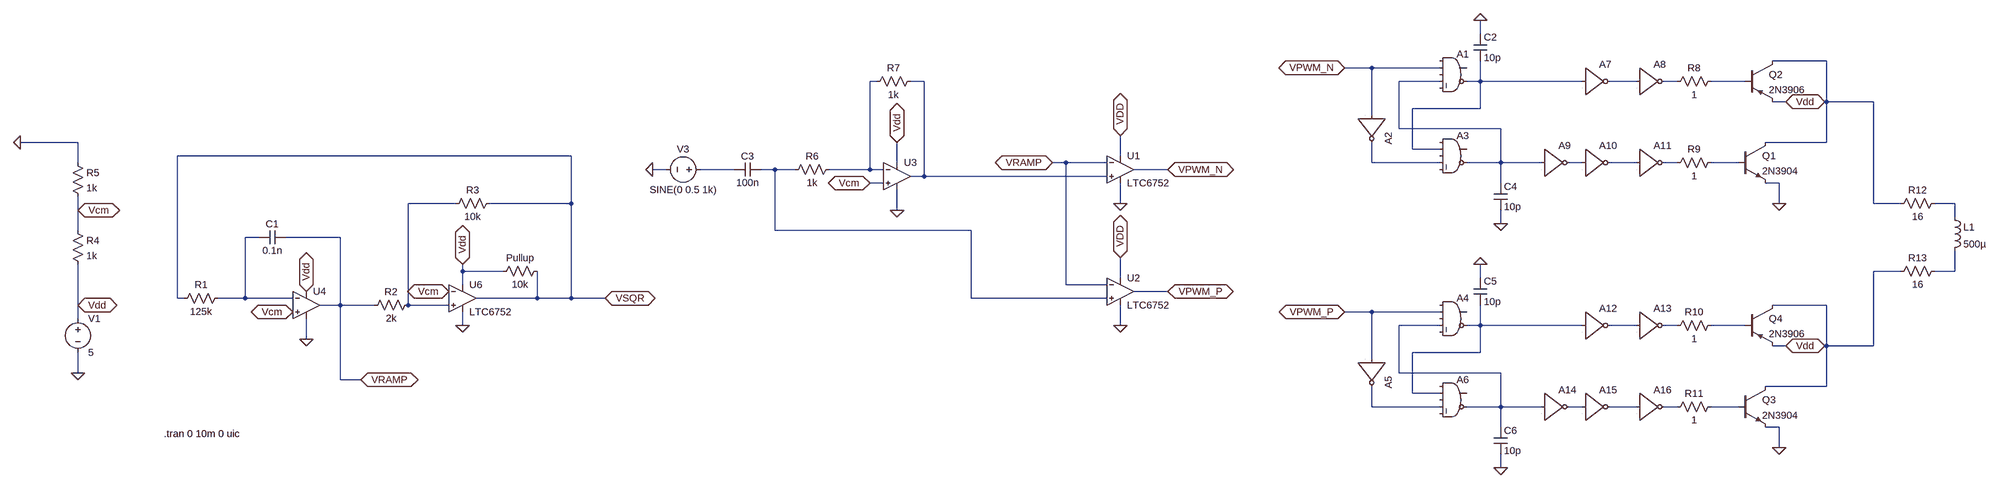
[diagram p0: schematic Experiment_5.asc]
Experiment_5.asc, the LTspice schematic file:
Version 4
SHEET 1 6772 1288
WIRE 5536 -432 5536 -464
WIRE 6352 -368 6224 -368
WIRE 5280 -352 5216 -352
WIRE 5440 -352 5280 -352
WIRE 3840 -320 3824 -320
WIRE 3952 -320 3920 -320
WIRE 5440 -320 5344 -320
WIRE 5536 -320 5536 -368
WIRE 5536 -320 5504 -320
WIRE 5776 -320 5536 -320
WIRE 5904 -320 5840 -320
WIRE 6000 -320 5968 -320
WIRE 6160 -320 6080 -320
WIRE 6256 -272 6224 -272
WIRE 6352 -272 6352 -368
WIRE 6496 -272 6352 -272
WIRE 5536 -256 5536 -320
WIRE 5536 -256 5376 -256
WIRE 5280 -240 5280 -352
WIRE 5344 -208 5344 -320
WIRE 5584 -208 5344 -208
WIRE 1936 -176 1792 -176
WIRE 6352 -176 6352 -272
WIRE 6352 -176 6208 -176
WIRE 5376 -160 5376 -256
WIRE 5440 -160 5376 -160
WIRE 3120 -144 2192 -144
WIRE 4496 -144 4496 -192
WIRE 1936 -128 1936 -176
WIRE 3888 -128 3888 -176
WIRE 4368 -128 4336 -128
WIRE 4464 -128 4368 -128
WIRE 5280 -128 5280 -176
WIRE 5440 -128 5280 -128
WIRE 5584 -128 5584 -208
WIRE 5584 -128 5504 -128
WIRE 5680 -128 5584 -128
WIRE 5776 -128 5744 -128
WIRE 5904 -128 5840 -128
WIRE 6000 -128 5968 -128
WIRE 6144 -128 6080 -128
WIRE 3344 -112 3312 -112
WIRE 3504 -112 3424 -112
WIRE 3600 -112 3568 -112
WIRE 3648 -112 3600 -112
WIRE 3824 -112 3824 -320
WIRE 3824 -112 3728 -112
WIRE 3856 -112 3824 -112
WIRE 4608 -112 4528 -112
WIRE 3952 -96 3952 -320
WIRE 3952 -96 3920 -96
WIRE 4464 -96 3952 -96
WIRE 3856 -80 3824 -80
WIRE 5584 -80 5584 -128
WIRE 6240 -80 6208 -80
WIRE 2848 -32 2736 -32
WIRE 3120 -32 3120 -144
WIRE 3120 -32 2928 -32
WIRE 4496 -32 4496 -80
WIRE 6240 -32 6240 -80
WIRE 6496 -32 6496 -272
WIRE 6560 -32 6496 -32
WIRE 6688 -32 6640 -32
WIRE 1936 -16 1936 -48
WIRE 3888 -16 3888 -64
WIRE 6688 0 6688 -32
WIRE 5584 16 5584 -16
WIRE 1936 32 1936 -16
WIRE 3600 32 3600 -112
WIRE 4144 32 3600 32
WIRE 2384 48 2352 48
WIRE 2576 48 2448 48
WIRE 2864 128 2864 112
WIRE 2960 128 2864 128
WIRE 6560 128 6496 128
WIRE 6688 128 6688 80
WIRE 6688 128 6640 128
WIRE 4496 144 4496 96
WIRE 5536 144 5536 112
WIRE 2864 160 2864 128
WIRE 4368 160 4368 -128
WIRE 4464 160 4368 160
WIRE 4608 176 4528 176
WIRE 2192 192 2192 -144
WIRE 2208 192 2192 192
WIRE 2352 192 2352 48
WIRE 2352 192 2288 192
WIRE 2464 192 2352 192
WIRE 3040 192 3040 128
WIRE 3040 192 2896 192
WIRE 3120 192 3120 -32
WIRE 3120 192 3040 192
WIRE 3200 192 3120 192
WIRE 4144 192 4144 32
WIRE 4464 192 4144 192
WIRE 1936 208 1936 112
WIRE 2576 208 2576 48
WIRE 2576 208 2528 208
WIRE 2656 208 2576 208
WIRE 2736 208 2736 -32
WIRE 2832 208 2736 208
WIRE 6352 208 6224 208
WIRE 5280 224 5216 224
WIRE 5440 224 5280 224
WIRE 1936 240 1936 208
WIRE 2864 256 2864 224
WIRE 4496 256 4496 208
WIRE 5440 256 5344 256
WIRE 5536 256 5536 208
WIRE 5536 256 5504 256
WIRE 5776 256 5536 256
WIRE 5904 256 5840 256
WIRE 6000 256 5968 256
WIRE 6160 256 6080 256
WIRE 2496 288 2496 240
WIRE 6256 304 6224 304
WIRE 6352 304 6352 208
WIRE 6496 304 6496 128
WIRE 6496 304 6352 304
WIRE 5536 320 5536 256
WIRE 5536 320 5376 320
WIRE 5280 336 5280 224
WIRE 1936 368 1936 320
WIRE 5344 368 5344 256
WIRE 5584 368 5344 368
WIRE 2576 384 2576 208
WIRE 2624 384 2576 384
WIRE 6352 400 6352 304
WIRE 6352 400 6208 400
WIRE 5376 416 5376 320
WIRE 5440 416 5376 416
WIRE 5280 448 5280 400
WIRE 5440 448 5280 448
WIRE 5584 448 5584 368
WIRE 5584 448 5504 448
WIRE 5680 448 5584 448
WIRE 5776 448 5744 448
WIRE 5904 448 5840 448
WIRE 6000 448 5968 448
WIRE 6144 448 6080 448
WIRE 5584 496 5584 448
WIRE 6240 496 6208 496
WIRE 6240 544 6240 496
WIRE 5584 592 5584 560
FLAG 2864 256 0
FLAG 1936 368 0
FLAG 1936 208 Vdd
IOPIN 1936 208 BiDir
FLAG 2496 288 0
FLAG 2864 112 Vdd
IOPIN 2864 112 BiDir
FLAG 2832 176 Vcm
IOPIN 2832 176 BiDir
FLAG 2496 176 Vdd
IOPIN 2496 176 BiDir
FLAG 2464 224 Vcm
IOPIN 2464 224 BiDir
FLAG 3200 192 VSQR
IOPIN 3200 192 BiDir
FLAG 2624 384 VRAMP
IOPIN 2624 384 BiDir
FLAG 3888 -16 0
FLAG 3888 -176 Vdd
IOPIN 3888 -176 BiDir
FLAG 3824 -80 Vcm
IOPIN 3824 -80 BiDir
FLAG 3312 -112 0
FLAG 4496 256 0
FLAG 4496 96 VDD
IOPIN 4496 96 BiDir
FLAG 4496 -32 0
FLAG 4496 -192 VDD
IOPIN 4496 -192 BiDir
FLAG 4336 -128 VRAMP
IOPIN 4336 -128 BiDir
FLAG 4608 -112 VPWM_N
IOPIN 4608 -112 BiDir
FLAG 4608 176 VPWM_P
IOPIN 4608 176 BiDir
FLAG 1792 -176 0
FLAG 1936 -16 Vcm
IOPIN 1936 -16 BiDir
FLAG 5584 16 0
FLAG 5536 -464 0
FLAG 5584 592 0
FLAG 5536 112 0
FLAG 5216 -352 VPWM_N
IOPIN 5216 -352 BiDir
FLAG 5216 224 VPWM_P
IOPIN 5216 224 BiDir
FLAG 6240 -32 0
FLAG 6256 -272 Vdd
IOPIN 6256 -272 BiDir
FLAG 6240 544 0
FLAG 6256 304 Vdd
IOPIN 6256 304 BiDir
SYMBOL res 2944 -48 R90
WINDOW 0 0 56 VBottom 2
WINDOW 3 32 56 VTop 2
SYMATTR InstName R3
SYMATTR Value 10k
SYMBOL res 2304 176 R90
WINDOW 0 0 56 VBottom 2
WINDOW 3 32 56 VTop 2
SYMATTR InstName R1
SYMATTR Value 125k
SYMBOL cap 2448 32 R90
WINDOW 0 0 32 VBottom 2
WINDOW 3 32 32 VTop 2
SYMATTR InstName C1
SYMATTR Value 0.1n
SYMBOL res 2752 192 R90
WINDOW 0 0 56 VBottom 2
WINDOW 3 32 56 VTop 2
SYMATTR InstName R2
SYMATTR Value 2k
SYMBOL voltage 1936 224 R0
WINDOW 123 0 0 Left 0
WINDOW 39 0 0 Left 0
SYMATTR InstName V1
SYMATTR Value 5
SYMBOL Opamps\\UniversalOpamp2 2496 208 R0
SYMATTR InstName U4
SYMBOL Comparators\\LTC6752 2864 128 R0
SYMATTR InstName U6
SYMBOL res 3056 112 R90
WINDOW 0 0 56 VBottom 2
WINDOW 3 32 56 VTop 2
SYMATTR InstName Pullup
SYMATTR Value 10k
SYMBOL cap 3568 -128 R90
WINDOW 0 0 32 VBottom 2
WINDOW 3 32 32 VTop 2
SYMATTR InstName C3
SYMATTR Value 100n
SYMBOL res 3744 -128 R90
WINDOW 0 0 56 VBottom 2
WINDOW 3 32 56 VTop 2
SYMATTR InstName R6
SYMATTR Value 1k
SYMBOL res 3936 -336 R90
WINDOW 0 0 56 VBottom 2
WINDOW 3 32 56 VTop 2
SYMATTR InstName R7
SYMATTR Value 1k
SYMBOL voltage 3440 -112 R90
WINDOW 0 -32 56 VBottom 2
WINDOW 3 32 56 VTop 2
WINDOW 123 0 0 Left 0
WINDOW 39 0 0 Left 0
SYMATTR InstName V3
SYMATTR Value SINE(0 0.5 1k)
SYMBOL Opamps\\UniversalOpamp2 3888 -96 R0
SYMATTR InstName U3
SYMBOL Comparators\\LTC6752 4496 -176 R0
SYMATTR InstName U1
SYMBOL Comparators\\LTC6752 4496 112 R0
SYMATTR InstName U2
SYMBOL res 1920 16 R0
SYMATTR InstName R4
SYMATTR Value 1k
SYMBOL res 1920 -144 R0
SYMATTR InstName R5
SYMATTR Value 1k
SYMBOL Digital\\and 5472 -400 R0
WINDOW 3 16 112 Invisible 2
SYMATTR InstName A1
SYMATTR Value Vhigh=5 Vlow=0
SYMATTR Value2 Td=10n
SYMBOL cap 5520 -432 R0
SYMATTR InstName C2
SYMATTR Value 10p
SYMBOL cap 5568 -80 R0
SYMATTR InstName C4
SYMATTR Value 10p
SYMBOL cap 5520 144 R0
SYMATTR InstName C5
SYMATTR Value 10p
SYMBOL cap 5568 496 R0
SYMATTR InstName C6
SYMATTR Value 10p
SYMBOL Digital\\inv 5776 -384 R0
WINDOW 3 8 104 Invisible 2
SYMATTR InstName A7
SYMATTR Value Vhigh=5 Vlow=0
SYMATTR Value2 Trise=5n Tfall=5n Td=5n
SYMBOL res 6096 -336 R90
WINDOW 0 0 56 VBottom 2
WINDOW 3 32 56 VTop 2
SYMATTR InstName R8
SYMATTR Value 1
SYMBOL res 6096 -144 R90
WINDOW 0 0 56 VBottom 2
WINDOW 3 32 56 VTop 2
SYMATTR InstName R9
SYMATTR Value 1
SYMBOL npn 6144 -176 R0
SYMATTR InstName Q1
SYMATTR Value 2N3904
SYMBOL pnp 6160 -368 R0
SYMATTR InstName Q2
SYMATTR Value 2N3906
SYMBOL res 6096 240 R90
WINDOW 0 0 56 VBottom 2
WINDOW 3 32 56 VTop 2
SYMATTR InstName R10
SYMATTR Value 1
SYMBOL res 6096 432 R90
WINDOW 0 0 56 VBottom 2
WINDOW 3 32 56 VTop 2
SYMATTR InstName R11
SYMATTR Value 1
SYMBOL npn 6144 400 R0
SYMATTR InstName Q3
SYMATTR Value 2N3904
SYMBOL pnp 6160 208 R0
SYMATTR InstName Q4
SYMATTR Value 2N3906
SYMBOL res 6656 -48 R90
WINDOW 0 0 56 VBottom 2
WINDOW 3 32 56 VTop 2
SYMATTR InstName R12
SYMATTR Value 16
SYMBOL res 6656 112 R90
WINDOW 0 0 56 VBottom 2
WINDOW 3 32 56 VTop 2
SYMATTR InstName R13
SYMATTR Value 16
SYMBOL Digital\\inv 5904 -384 R0
WINDOW 3 8 104 Invisible 2
SYMATTR InstName A8
SYMATTR Value Vhigh=5 Vlow=0
SYMATTR Value2 Trise=5n Tfall=5n Td=5n
SYMBOL Digital\\inv 5776 -192 R0
WINDOW 3 8 104 Invisible 2
SYMATTR InstName A10
SYMATTR Value Vhigh=5 Vlow=0
SYMATTR Value2 Trise=5n Tfall=5n Td=5n
SYMBOL Digital\\inv 5904 -192 R0
WINDOW 3 8 104 Invisible 2
SYMATTR InstName A11
SYMATTR Value Vhigh=5 Vlow=0
SYMATTR Value2 Trise=5n Tfall=5n Td=5n
SYMBOL Digital\\inv 5776 192 R0
WINDOW 3 8 104 Invisible 2
SYMATTR InstName A12
SYMATTR Value Vhigh=5 Vlow=0
SYMATTR Value2 Trise=5n Tfall=5n Td=5n
SYMBOL Digital\\inv 5904 192 R0
WINDOW 3 8 104 Invisible 2
SYMATTR InstName A13
SYMATTR Value Vhigh=5 Vlow=0
SYMATTR Value2 Trise=5n Tfall=5n Td=5n
SYMBOL Digital\\inv 5680 384 R0
WINDOW 3 8 104 Invisible 2
SYMATTR InstName A14
SYMATTR Value Vhigh=5 Vlow=0
SYMATTR Value2 Trise=5n Tfall=5n Td=5n
SYMBOL Digital\\inv 5776 384 R0
WINDOW 3 8 104 Invisible 2
SYMATTR InstName A15
SYMATTR Value Vhigh=5 Vlow=0
SYMATTR Value2 Trise=5n Tfall=5n Td=5n
SYMBOL Digital\\inv 5904 384 R0
WINDOW 3 8 104 Invisible 2
SYMATTR InstName A16
SYMATTR Value Vhigh=5 Vlow=0
SYMATTR Value2 Trise=5n Tfall=5n Td=5n
SYMBOL ind 6672 -16 R0
SYMATTR InstName L1
SYMATTR Value 500µ
SYMBOL Digital\\inv 5344 -240 R90
WINDOW 3 8 104 Invisible 2
SYMATTR InstName A2
SYMATTR Value Vhigh=5 Vlow=0
SYMATTR Value2 Trise=5n Tfall=5n Td=5n
SYMBOL Digital\\inv 5344 336 R90
WINDOW 3 8 104 Invisible 2
SYMATTR InstName A5
SYMATTR Value Vhigh=5 Vlow=0
SYMATTR Value2 Trise=5n Tfall=5n Td=5n
SYMBOL Digital\\inv 5680 -192 R0
WINDOW 3 8 104 Invisible 2
SYMATTR InstName A9
SYMATTR Value Vhigh=5 Vlow=0
SYMATTR Value2 Trise=5n Tfall=5n Td=5n
SYMBOL Digital\\and 5472 -208 R0
WINDOW 3 16 112 Invisible 2
SYMATTR InstName A3
SYMATTR Value Vhigh=5 Vlow=0
SYMATTR Value2 Td=10n
SYMBOL Digital\\and 5472 176 R0
WINDOW 3 16 112 Invisible 2
SYMATTR InstName A4
SYMATTR Value Vhigh=5 Vlow=0
SYMATTR Value2 Td=10n
SYMBOL Digital\\and 5472 368 R0
WINDOW 3 16 112 Invisible 2
SYMATTR InstName A6
SYMATTR Value Vhigh=5 Vlow=0
SYMATTR Value2 Td=10n
TEXT 2160 512 Left 2 !.tran 0 10m 0 uic

The netlist it stands for:
* Experiment_5.asc
R3 VSQR N016 10k
R1 N018 VSQR 125k
C1 VRAMP N018 0.1n
R2 N016 VRAMP 2k
V1 Vdd 0 5
XU4 Vcm N018 Vdd 0 VRAMP level.2 Avol=1Meg GBW=10Meg Slew=10Meg ilimit=25m rail=0 Vos=0 phimargin=45 en=0 enk=0 in=0 ink=0 Rin=500Meg  ; pins IN+ IN- V+ V- OUT
XU6 N016 Vcm Vdd 0 VSQR LTC6752  ; pins In+ In- V+ V- OUT
R§Pullup VSQR Vdd 10k
C3 N015 N014 100n
R6 N002 N015 1k
R7 N003 N002 1k
V3 N014 0 SINE(0 0.5 1k)
XU3 Vcm N002 Vdd 0 N003 level.2 Avol=1Meg GBW=10Meg Slew=10Meg ilimit=25m rail=0 Vos=0 phimargin=45 en=0 enk=0 in=0 ink=0 Rin=500Meg  ; pins IN+ IN- V+ V- OUT
XU1 N003 VRAMP Vdd 0 VPWM_N LTC6752  ; pins In+ In- V+ V- OUT
XU2 N015 VRAMP Vdd 0 VPWM_P LTC6752  ; pins In+ In- V+ V- OUT
R4 Vcm Vdd 1k
R5 0 Vcm 1k
A1 0 VPWM_N 0 N004 0 N005 0 0 AND Vhigh=5 Vlow=0 Td=10n
C2 0 N005 10p
C4 N004 0 10p
C5 0 N022 10p
C6 N021 0 10p
A7 N005 0 0 0 0 N006 0 0 BUF Vhigh=5 Vlow=0 Trise=5n Tfall=5n Td=5n
R8 N008 N007 1
R9 N013 N012 1
Q1 N001 N013 0 0 2N3904
Q2 N001 N008 Vdd 0 2N3906
R10 N025 N024 1
R11 N030 N029 1
Q3 N019 N030 0 0 2N3904
Q4 N019 N025 Vdd 0 2N3906
R12 N017 N001 16
R13 N020 N019 16
A8 N006 0 0 0 0 N007 0 0 BUF Vhigh=5 Vlow=0 Trise=5n Tfall=5n Td=5n
A10 N010 0 0 0 0 N011 0 0 BUF Vhigh=5 Vlow=0 Trise=5n Tfall=5n Td=5n
A11 N011 0 0 0 0 N012 0 0 BUF Vhigh=5 Vlow=0 Trise=5n Tfall=5n Td=5n
A12 N022 0 0 0 0 N023 0 0 BUF Vhigh=5 Vlow=0 Trise=5n Tfall=5n Td=5n
A13 N023 0 0 0 0 N024 0 0 BUF Vhigh=5 Vlow=0 Trise=5n Tfall=5n Td=5n
A14 N021 0 0 0 0 N027 0 0 BUF Vhigh=5 Vlow=0 Trise=5n Tfall=5n Td=5n
A15 N027 0 0 0 0 N028 0 0 BUF Vhigh=5 Vlow=0 Trise=5n Tfall=5n Td=5n
A16 N028 0 0 0 0 N029 0 0 BUF Vhigh=5 Vlow=0 Trise=5n Tfall=5n Td=5n
L1 N017 N020 500µ
A2 VPWM_N 0 0 0 0 N009 0 0 BUF Vhigh=5 Vlow=0 Trise=5n Tfall=5n Td=5n
A5 VPWM_P 0 0 0 0 N026 0 0 BUF Vhigh=5 Vlow=0 Trise=5n Tfall=5n Td=5n
A9 N004 0 0 0 0 N010 0 0 BUF Vhigh=5 Vlow=0 Trise=5n Tfall=5n Td=5n
A3 0 N005 0 N009 0 N004 0 0 AND Vhigh=5 Vlow=0 Td=10n
A4 0 VPWM_P 0 N021 0 N022 0 0 AND Vhigh=5 Vlow=0 Td=10n
A6 0 N022 0 N026 0 N021 0 0 AND Vhigh=5 Vlow=0 Td=10n
.model NPN NPN
.model PNP PNP
.lib standard.bjt
.tran 0 10m 0 uic
.lib UniversalOpamps2.sub
.lib LTC7.lib
.backanno
.end